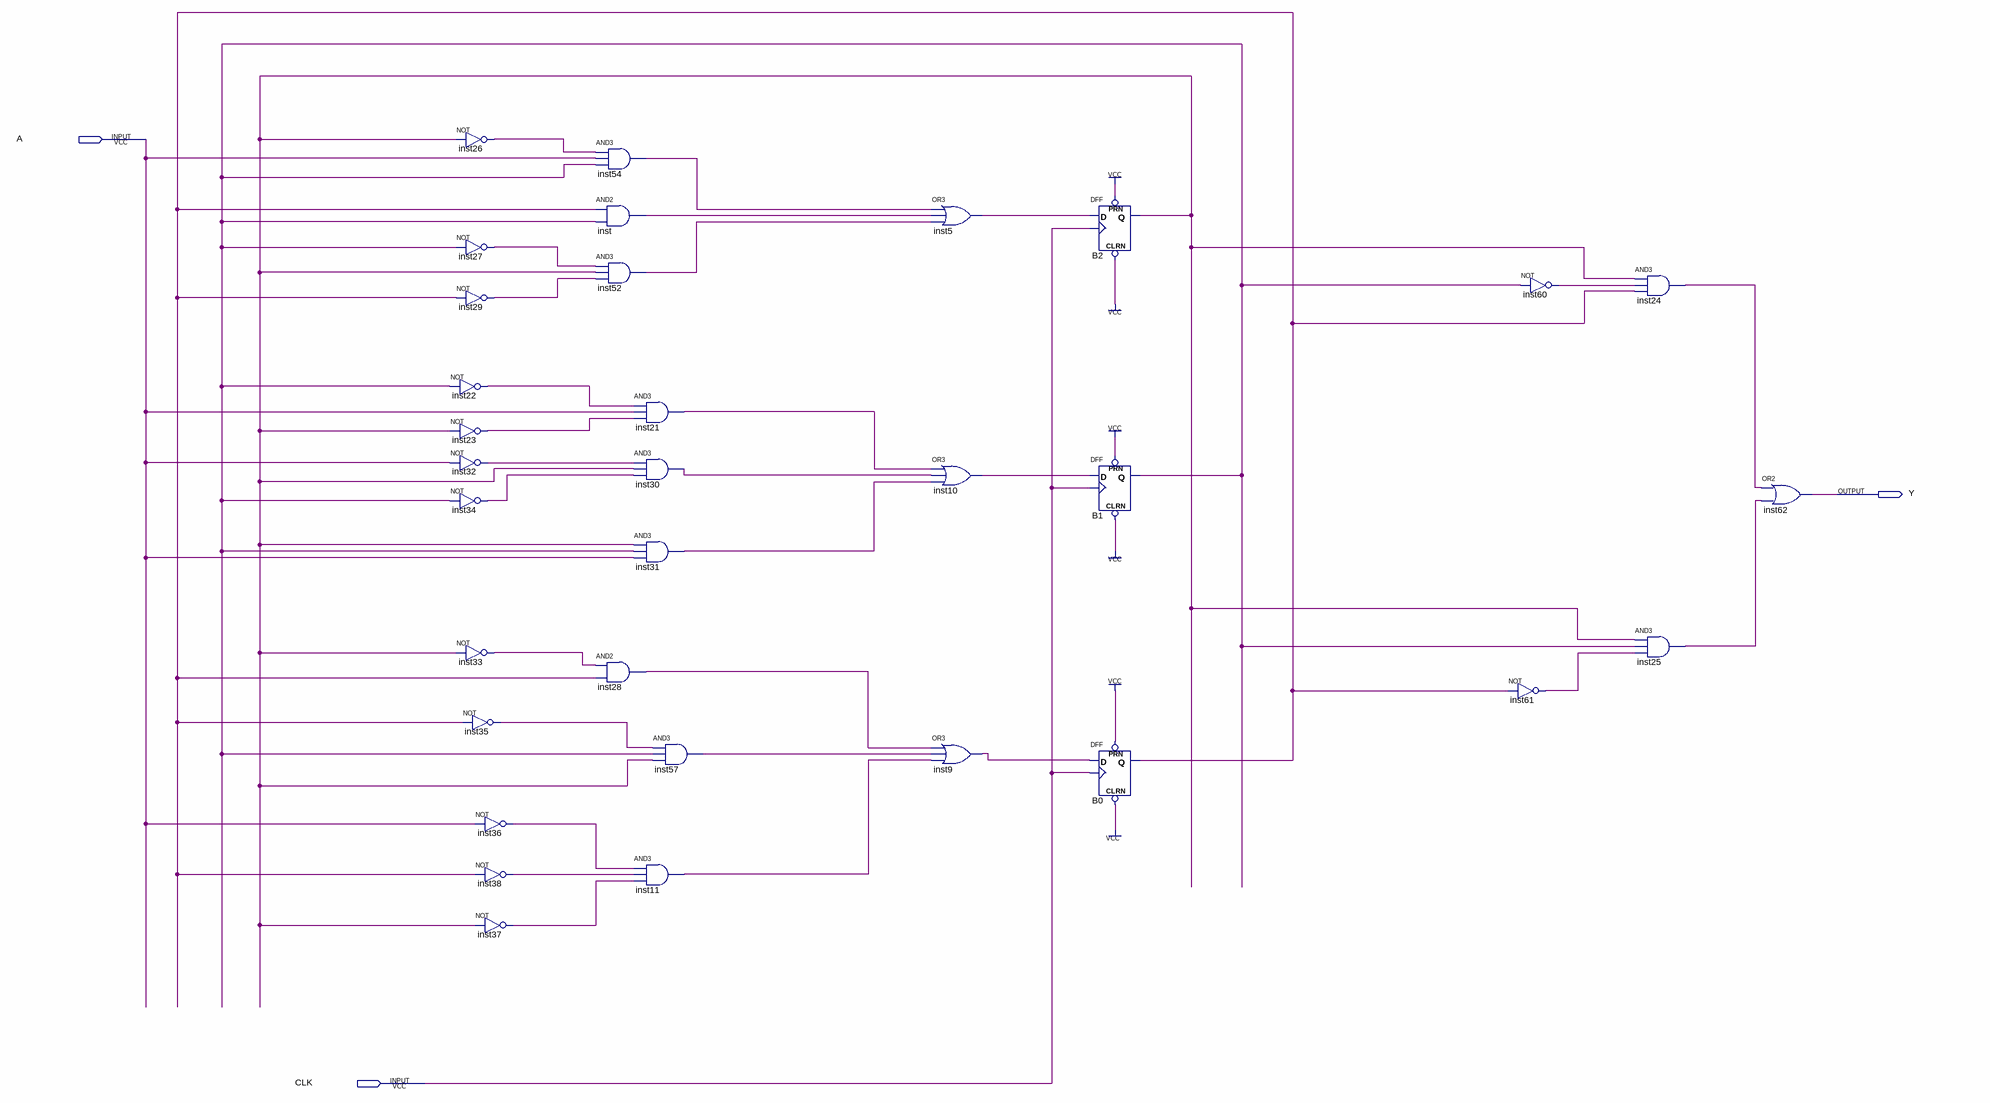
[diagram p0: schematic sheet]
// Quartus schematic Dev2No2a.bdf as structural Verilog: 32 symbols, 3 pins
module Dev2No2a (
  input  A,
  input  CLK,
  output Y
);

  wire B0_q, B1_q, B2_q, inst5_out, inst9_out, inst10_out, inst11_out, inst21_out, inst22_out, inst23_out,
       inst24_out, inst25_out, inst26_out, inst27_out, inst28_out, inst29_out, inst30_out, inst31_out,
       inst32_out, inst33_out, inst34_out, inst35_out, inst36_out, inst37_out, inst38_out, inst52_out,
       inst54_out, inst57_out, inst60_out, inst61_out, inst_out;

  not inst26 (inst26_out, B2_q);
  not inst27 (inst27_out, B1_q);
  not inst29 (inst29_out, B0_q);
  not inst22 (inst22_out, B1_q);
  not inst23 (inst23_out, B2_q);
  not inst32 (inst32_out, A);
  not inst34 (inst34_out, B1_q);
  not inst33 (inst33_out, B2_q);
  not inst35 (inst35_out, B0_q);
  not inst36 (inst36_out, A);
  not inst38 (inst38_out, B0_q);
  not inst37 (inst37_out, B2_q);
  and inst54 (inst54_out, inst26_out, A, B1_q);
  and inst (inst_out, B0_q, B1_q);
  and inst52 (inst52_out, inst27_out, B2_q, inst29_out);
  and inst28 (inst28_out, inst33_out, B0_q);
  and inst21 (inst21_out, inst22_out, A, inst23_out);
  and inst30 (inst30_out, inst32_out, B2_q, inst34_out);
  and inst31 (inst31_out, B2_q, B1_q, A);
  and inst57 (inst57_out, inst35_out, B1_q, B2_q);
  and inst11 (inst11_out, inst36_out, inst38_out, inst37_out);
  or inst5 (inst5_out, inst54_out, inst_out, inst52_out);
  or inst10 (inst10_out, inst21_out, inst30_out, inst31_out);
  or inst9 (inst9_out, inst28_out, inst57_out, inst11_out);
  DFF B2 (.CLRN(1'b1), .CLK(CLK), .D(inst5_out), .PRN(1'b1), .Q(B2_q));
  DFF B1 (.CLRN(1'b1), .CLK(CLK), .D(inst10_out), .PRN(1'b1), .Q(B1_q));
  DFF B0 (.CLRN(1'b1), .CLK(CLK), .D(inst9_out), .PRN(1'b1), .Q(B0_q));
  not inst60 (inst60_out, B1_q);
  not inst61 (inst61_out, B0_q);
  and inst24 (inst24_out, B2_q, inst60_out, B0_q);
  and inst25 (inst25_out, B2_q, B1_q, inst61_out);
  or inst62 (Y, inst24_out, inst25_out);
endmodule
